# Altium schematic sheet FPGA_Peripherals_Control.SchDoc
size A4
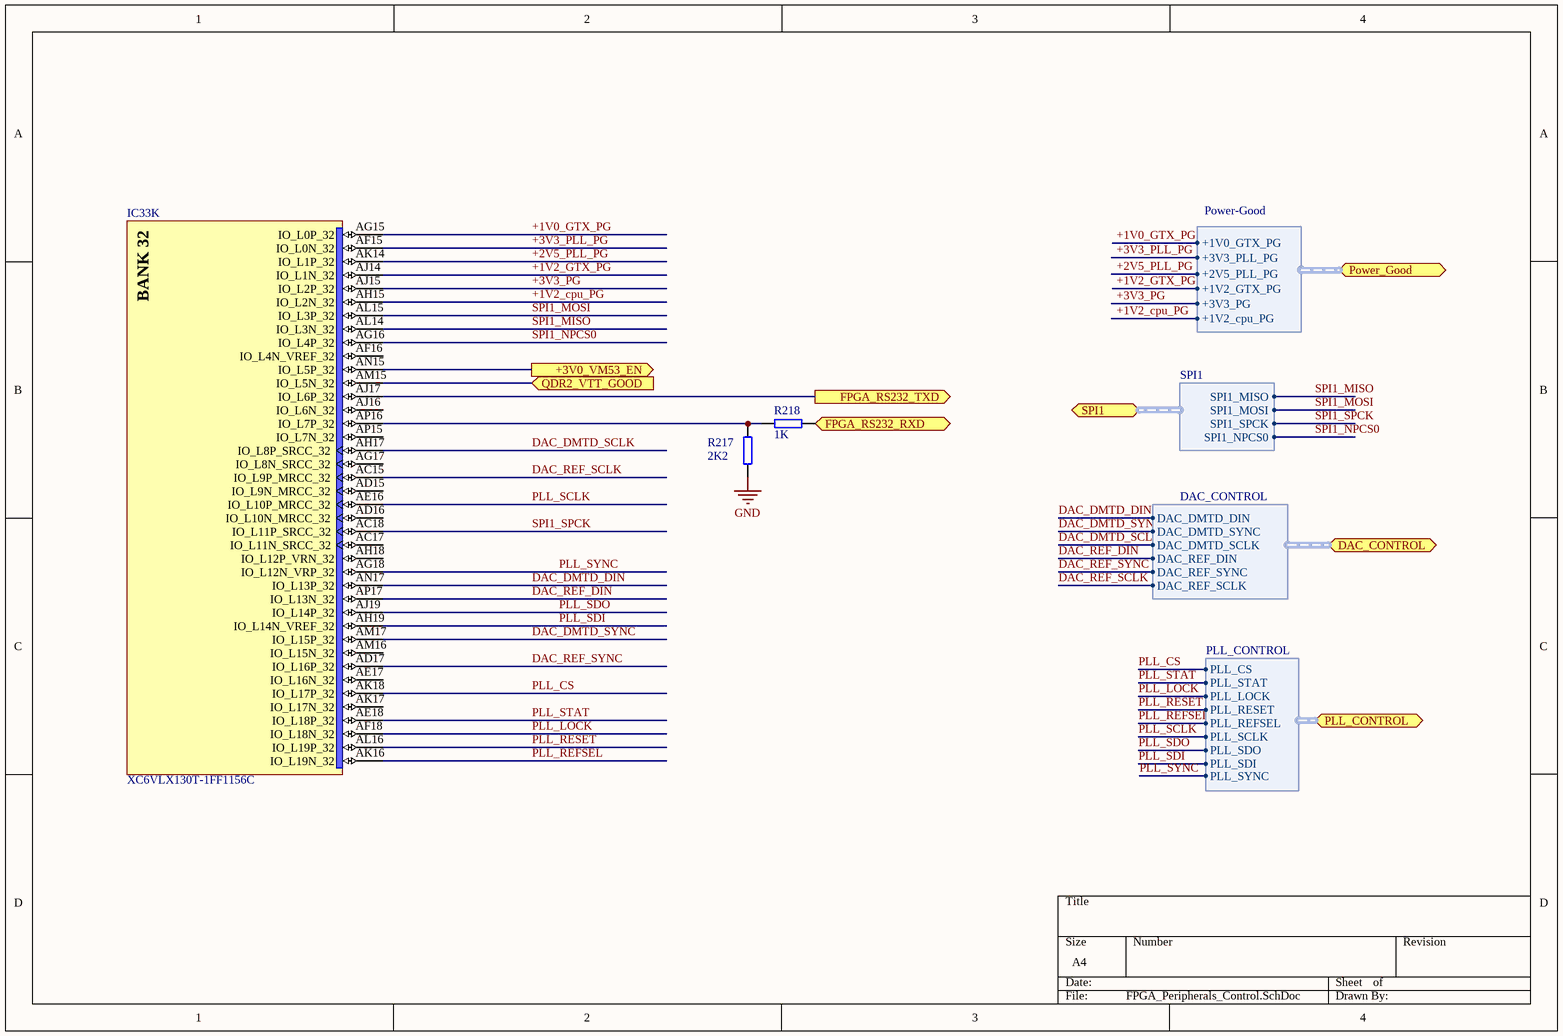
[diagram p0: FPGA_Peripherals_Control.SchDoc]

## Parts
IC33  XC6VLX130T-1FF1156C  [FF1156]  (part K of 20)
R217  2K2  [0402]
R218  1K  [0402]

## Ports
+3V0_VM53_EN (out), DAC_CONTROL (harness DAC_CONTROL), FPGA_RS232_RXD (in), FPGA_RS232_TXD (out), PLL_CONTROL (harness PLL_CONTROL), Power_Good (harness Power-Good), QDR2_VTT_GOOD (in), SPI1 (harness SPI1)

## Harnesses
SPI1: SPI1_MISO, SPI1_MOSI, SPI1_SPCK, SPI1_NPCS0
Power-Good: +1V2_GTX_PG, +2V5_PLL_PG, +3V3_PLL_PG, +1V0_GTX_PG, +3V3_PG, +1V2_cpu_PG
DAC_CONTROL: DAC_DMTD_DIN, DAC_DMTD_SYNC, DAC_DMTD_SCLK, DAC_REF_DIN, DAC_REF_SYNC, DAC_REF_SCLK
PLL_CONTROL: PLL_CS, PLL_STAT, PLL_LOCK, PLL_RESET, PLL_REFSEL, PLL_SCLK, PLL_SDO, PLL_SDI, PLL_SYNC

## Nets
GND: R217.2
+1V0_GTX_PG: IC33.AG15(IO_L0P_32) ; port Power_Good.+1V0_GTX_PG
+1V2_cpu_PG: IC33.AH15(IO_L2N_32) ; port Power_Good.+1V2_cpu_PG
+1V2_GTX_PG: IC33.AJ14(IO_L1N_32) ; port Power_Good.+1V2_GTX_PG
+2V5_PLL_PG: IC33.AK14(IO_L1P_32) ; port Power_Good.+2V5_PLL_PG
+3V0_VM53_EN: IC33.AN15(IO_L5P_32) ; port +3V0_VM53_EN
+3V3_PG: IC33.AJ15(IO_L2P_32) ; port Power_Good.+3V3_PG
+3V3_PLL_PG: IC33.AF15(IO_L0N_32) ; port Power_Good.+3V3_PLL_PG
DAC_DMTD_DIN: IC33.AN17(IO_L13P_32) ; port DAC_CONTROL.DAC_DMTD_DIN
DAC_DMTD_SCLK: IC33.AH17(IO_L8P_SRCC_32) ; port DAC_CONTROL.DAC_DMTD_SCLK
DAC_DMTD_SYNC: IC33.AM17(IO_L15P_32) ; port DAC_CONTROL.DAC_DMTD_SYNC
DAC_REF_DIN: IC33.AP17(IO_L13N_32) ; port DAC_CONTROL.DAC_REF_DIN
DAC_REF_SCLK: IC33.AC15(IO_L9P_MRCC_32) ; port DAC_CONTROL.DAC_REF_SCLK
DAC_REF_SYNC: IC33.AD17(IO_L16P_32) ; port DAC_CONTROL.DAC_REF_SYNC
FPGA_RS232_RXD: R218.1 ; port FPGA_RS232_RXD
FPGA_RS232_TXD: IC33.AJ17(IO_L6P_32) ; port FPGA_RS232_TXD
PLL_CS: IC33.AK18(IO_L17P_32) ; port PLL_CONTROL.PLL_CS
PLL_LOCK: IC33.AF18(IO_L18N_32) ; port PLL_CONTROL.PLL_LOCK
PLL_REFSEL: IC33.AK16(IO_L19N_32) ; port PLL_CONTROL.PLL_REFSEL
PLL_RESET: IC33.AL16(IO_L19P_32) ; port PLL_CONTROL.PLL_RESET
PLL_SCLK: IC33.AE16(IO_L10P_MRCC_32) ; port PLL_CONTROL.PLL_SCLK
PLL_SDI: IC33.AH19(IO_L14N_VREF_32) ; port PLL_CONTROL.PLL_SDI
PLL_SDO: IC33.AJ19(IO_L14P_32) ; port PLL_CONTROL.PLL_SDO
PLL_STAT: IC33.AE18(IO_L18P_32) ; port PLL_CONTROL.PLL_STAT
PLL_SYNC: IC33.AG18(IO_L12N_VRP_32) ; port PLL_CONTROL.PLL_SYNC
QDR2_VTT_GOOD: IC33.AM15(IO_L5N_32) ; port QDR2_VTT_GOOD
SPI1_MISO: IC33.AL14(IO_L3N_32) ; port SPI1.SPI1_MISO
SPI1_MOSI: IC33.AL15(IO_L3P_32) ; port SPI1.SPI1_MOSI
SPI1_NPCS0: IC33.AG16(IO_L4P_32) ; port SPI1.SPI1_NPCS0
SPI1_SPCK: IC33.AC18(IO_L11P_SRCC_32) ; port SPI1.SPI1_SPCK
NetIC33_AP16: IC33.AP16(IO_L7P_32) R217.1 R218.2

Not connected (* = marked no-connect by the designer): IC33 AC17(IO_L11N_SRCC_32) AD15(IO_L9N_MRCC_32) AD16(IO_L10N_MRCC_32) AE17(IO_L16N_32) AF16(IO_L4N_VREF_32) AG17(IO_L8N_SRCC_32) AH18(IO_L12P_VRN_32) AJ16(IO_L6N_32) AK17(IO_L17N_32) AM16(IO_L15N_32) AP15(IO_L7N_32)

## Notes on the sheet
- (in symbol XC6VLX130T-1FF1156C, part K) BANK 32

## Library data of the parts
IC33 = XC6VLX130T-1FF1156C: Virtex-6 LXT Platform FPGA, 600 User I/Os, 20 GTXs, 1156-Ball FFBGA, Speed Grade 1, Commercial Grade; FirstPublished: 17-Nov-2009; DatasheetVersion: v2.0, Sep-2009; PackageVersion: ver1.0, Jun-2009; PackageReference: FF1156; Publisher: Altium Limited; PackageDescription: 1156-Ball Flip-Chip Fine Pitch Ball Grid Array (FF1156); Code_JEDEC: MS-034-AAR-1; Code_IPC: BGA100P34X34-1156; ComponentLink1Description: Virtex-6 Datasheet; ComponentLink1URL: http://www.xilinx.com/support/documentation/data_sheets/ds150.pdf; ComponentLink2Description: Pinout Specification; ComponentLink2URL: http://www.xilinx.com/support/packagefiles/virtex-6-pkgs.htm; ComponentLink3Description: FF1156 Package Drawing; ComponentLink3URL: http://www.xilinx.com/support/documentation/package_specs/ff1156.pdf; ComponentLink4Description: Virtex-6 Documents; ComponentLink4URL: http://www.xilinx.com/support/documentation/virtex-6.htm; ComponentLink5Description: Xilinx.com Home; ComponentLink5URL: http://www.xilinx.com
R217 = R0402_2K2_±1%_0.1W_100PPM: SMD Resistor; Manufacturer1: Panasonic; Manufacturer1 PN: ERJ-2RKF2201X; TCR: 100ppm; Power Rating: 0.1W; Tolerance: ±1%; Case: 0402; Distributor1: DigiKey; Distributor1 PN: P2.20KLCT-ND; Value: 2K2
R218 = R0402_1K_±1%_0.1W_100PPM: SMD Resistor; Manufacturer1: Panasonic; Manufacturer1 PN: ERJ-2RKF1001X; TCR: 100ppm; Power Rating: 0.1W; Tolerance: ±1%; Case: 0402; Distributor1: DigiKey; Distributor1 PN: P1.00KLCT-ND; Value: 1K